# Altium schematic sheet Dc_Dc_SheetSchDoc.SchDoc
size A2
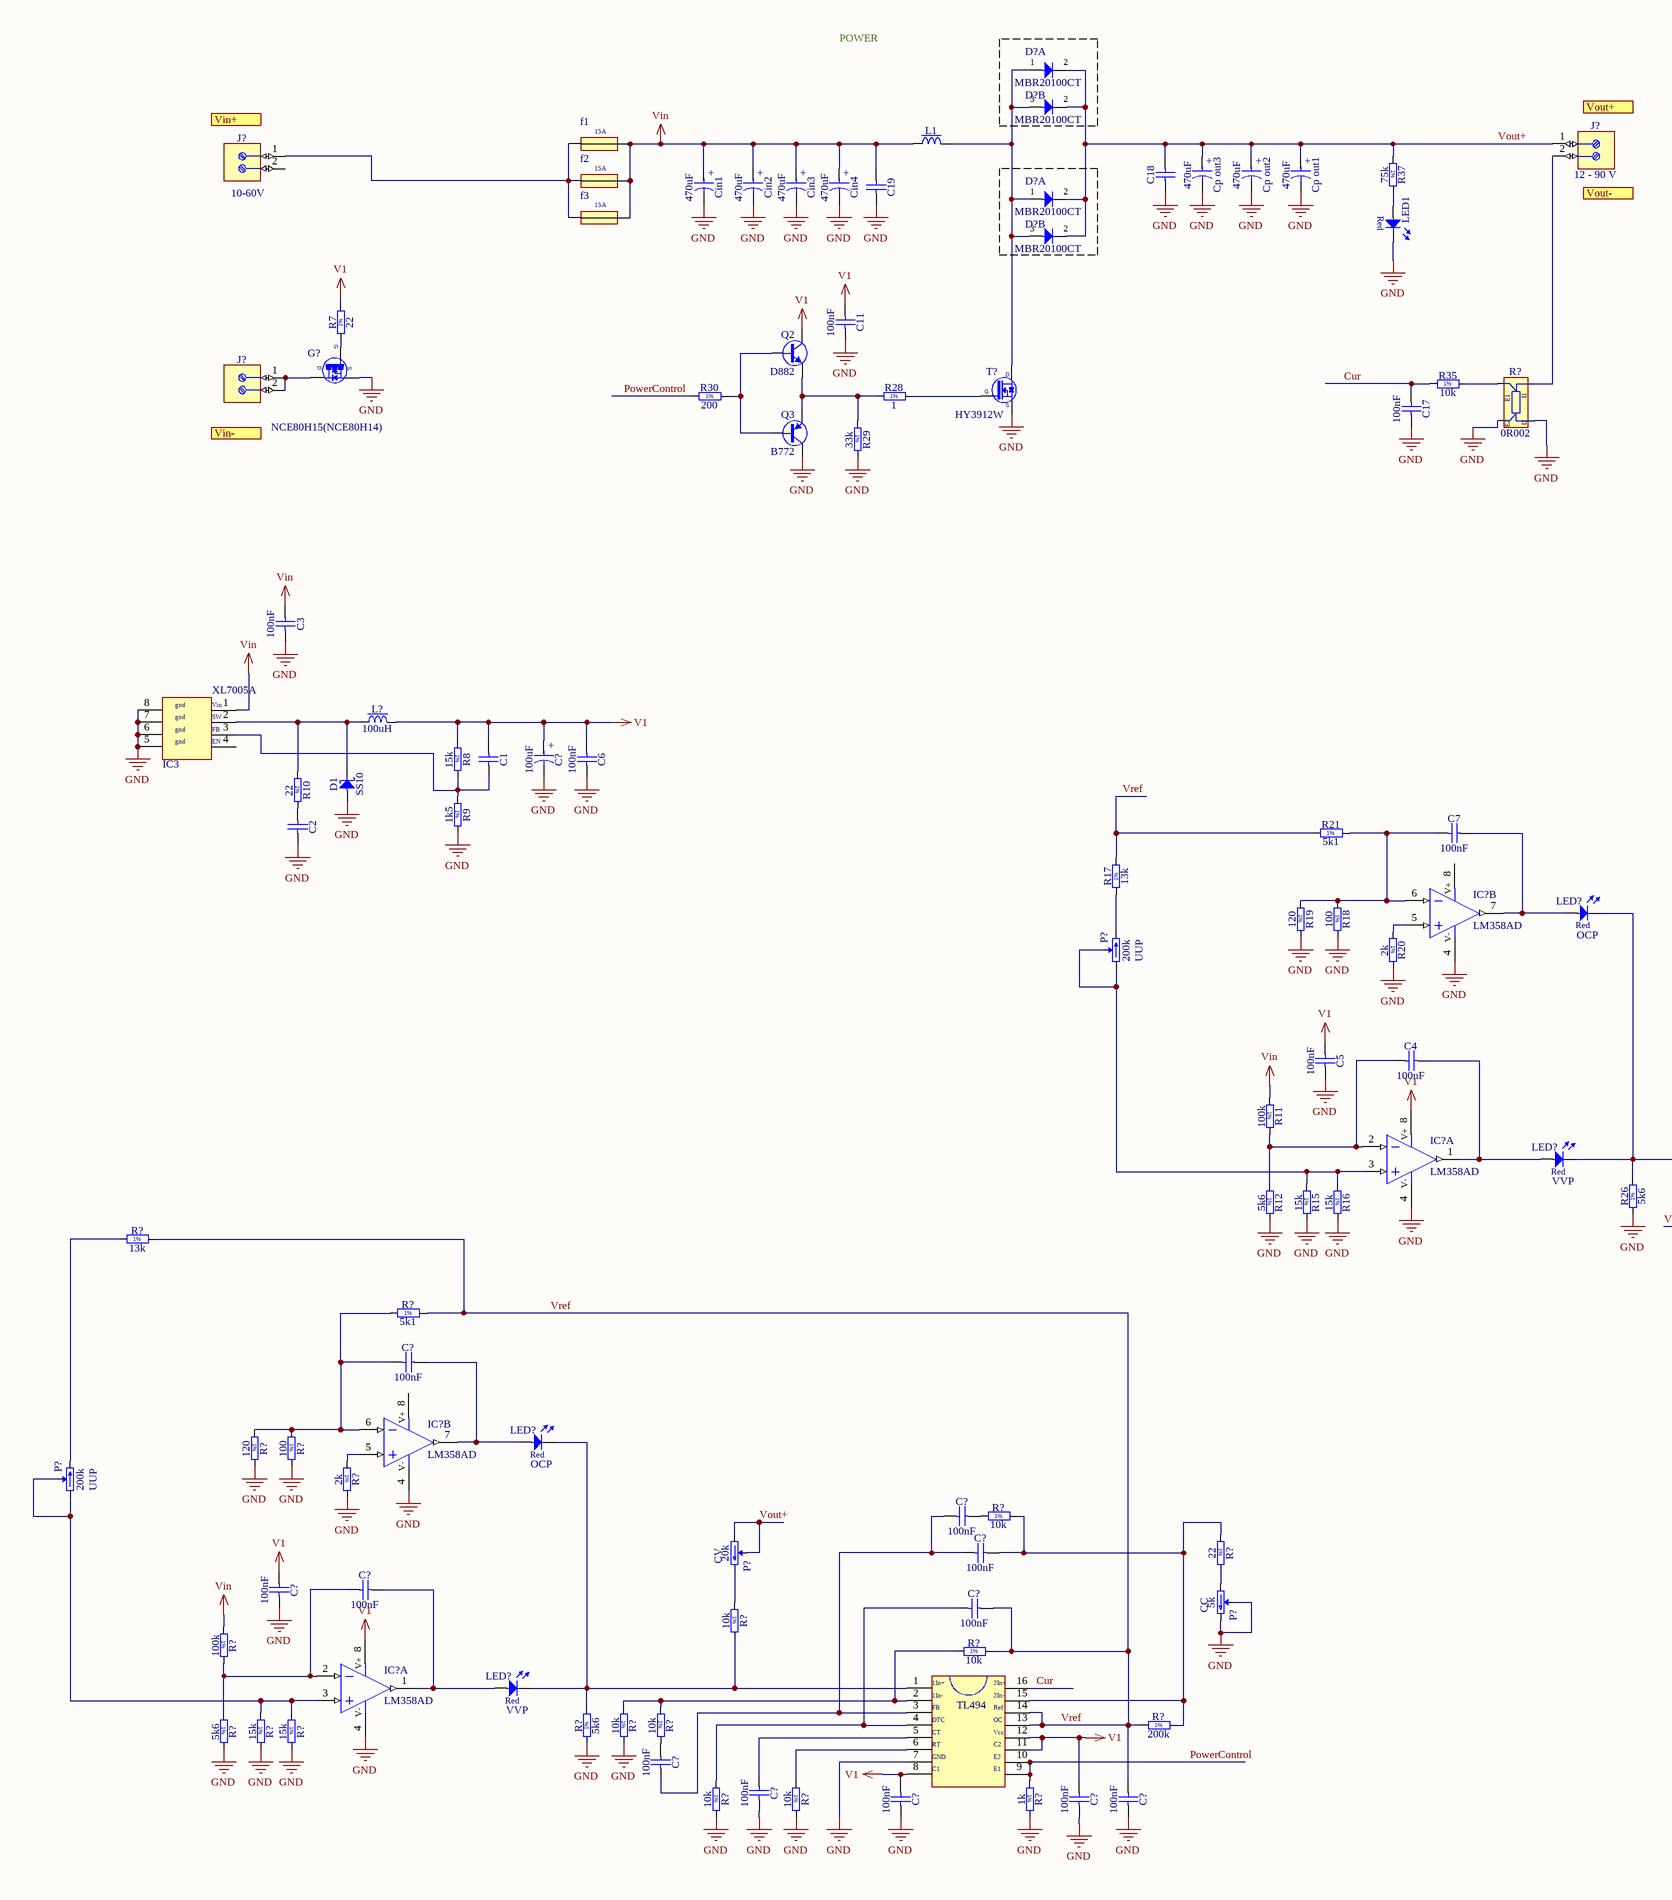
[diagram p0: Dc_Dc_SheetSchDoc.SchDoc, left]
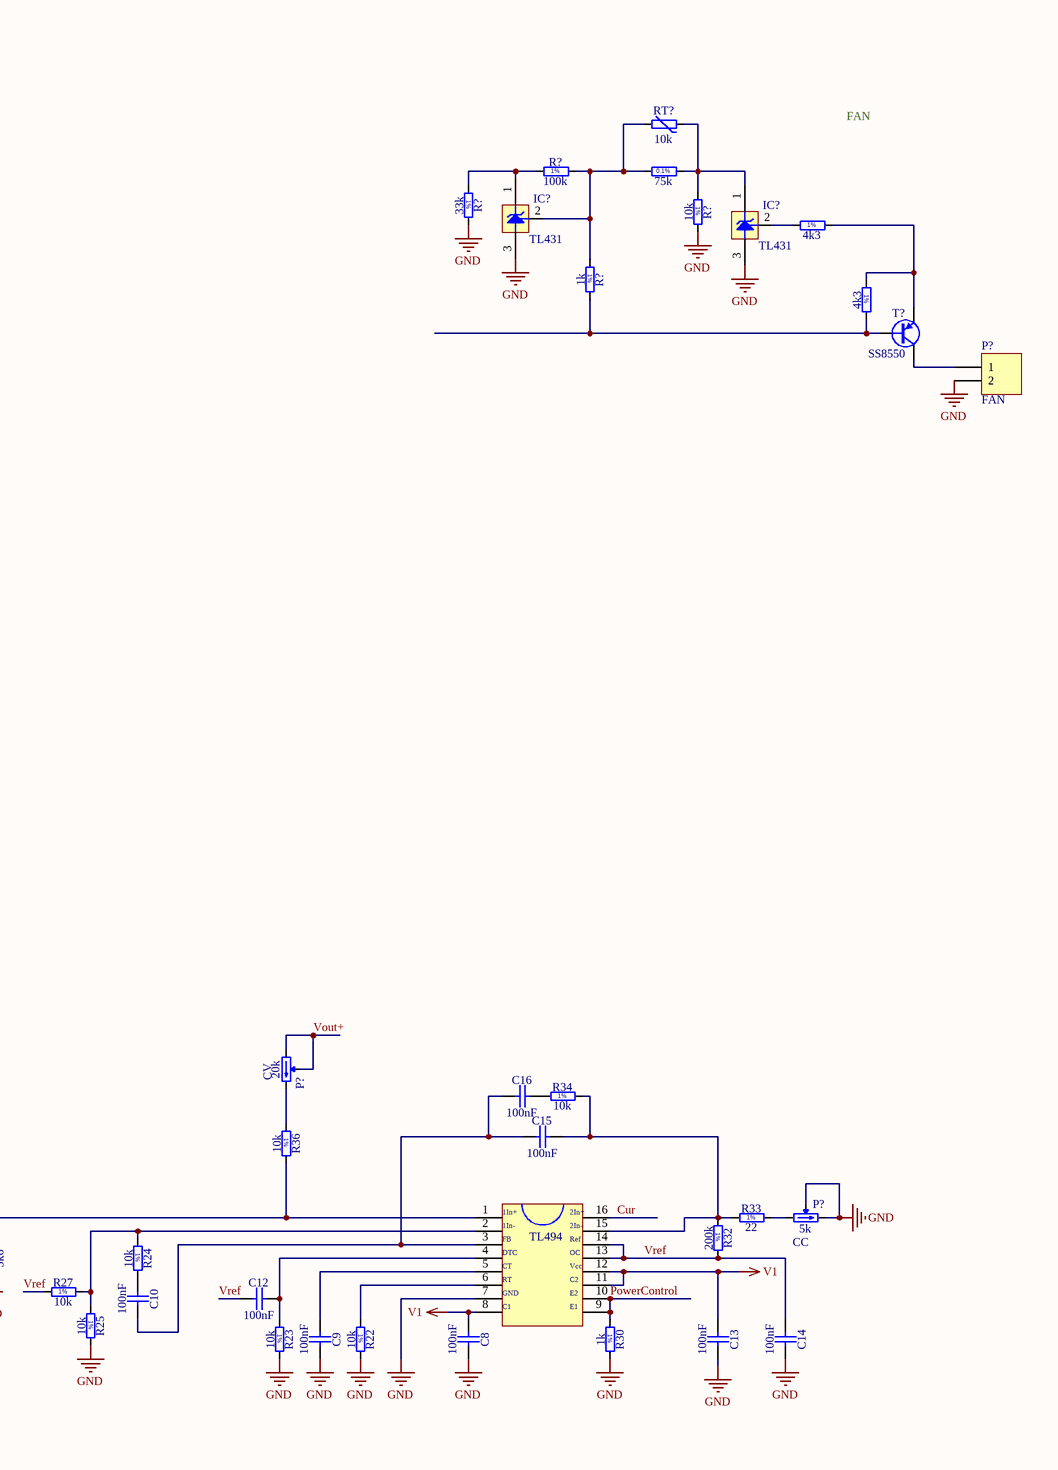
[diagram p1: Dc_Dc_SheetSchDoc.SchDoc, right]

## Parts
(Parts that share a designator on the sheet are numbered #1, #2 ... from top to bottom, then left to right.)
1  1  (value not drawn)  (part B of 2)
?  1  (value not drawn)  (part B of 2)
C1  100nF  [CAPC2012X135N]  (value not drawn)
C2  100nF  [CAPC2012X135N]  (value not drawn)
C3  100nF  [CAPC2012X135N]
C4  100nF  [CAPC2012X135N]
C5  100nF  [CAPC2012X135N]
C6  100nF  [CAPC2012X135N]
C7  100nF  [CAPC2012X135N]
C8  100nF  [CAPC2012X135N]
C9  100nF  [CAPC2012X135N]
C10  100nF  [CAPC2012X135N]
C11  100nF  [CAPC2012X135N]
C12  100nF  [CAPC2012X135N]
C13  100nF  [CAPC2012X135N]
C14  100nF  [CAPC2012X135N]
C15  100nF  [CAPC2012X135N]
C16  100nF  [CAPC2012X135N]
C17  100nF  [CAPC2012X135N]
C18  470nF  [CAPC3216X100N]  (value not drawn)
C19  470nF  [CAPC3216X100N]  (value not drawn)
C?#1  100uF  [CAPPR250-680X1250]
C?#2  100nF  [CAPC2012X135N]
C?#3  100nF  [CAPC2012X135N]
C?#4  100nF  [CAPC2012X135N]
C?#5  100nF  [CAPC2012X135N]
C?#6  100nF  [CAPC2012X135N]
C?#7  100nF  [CAPC2012X135N]
C?#8  100nF  [CAPC2012X135N]
C?#9  100nF  [CAPC2012X135N]
C?#10  100nF  [CAPC2012X135N]
C?#11  100nF  [CAPC2012X135N]
C?#12  100nF  [CAPC2012X135N]
Cin1  470uF  [CAPPR750-1650X2700]
Cin2  470uF  [CAPPR750-1650X2700]
Cin3  470uF  [CAPPR750-1650X2700]
Cin4  470uF  [CAPPR750-1650X2700]
Cp_out1  470uF  [CAPPR750-1650X2700]
Cp_out2  470uF  [CAPPR750-1650X2700]
Cp_out3  470uF  [CAPPR750-1650X2700]
D1  SS10  [DIOM5127X229N]
D?#1  MBR20100CT  [TO-220-V]  (part A of 2)
D?#2  MBR20100CT  [TO-220-V]  (part B of 2)
D?#3  MBR20100CT  [TO-220-V]  (part A of 2)
D?#4  MBR20100CT  [TO-220-V]  (part B of 2)
f1  fuse  (value not drawn)
f2  fuse  (value not drawn)
f3  fuse  (value not drawn)
G?  NCE80H15(NCE80H14)  [TO-220-v]
IC3  XL7005A  (value not drawn)
IC?#1  TL431  [SOT95P237X112-3N]
IC?#2  TL431  [SOT95P237X112-3N]
IC?#3  LM358AD  [SOIC127P600X175-8N]  (part B of 2)
IC?#4  LM358AD  [SOIC127P600X175-8N]  (part A of 2)
IC?#5  LM358AD  [SOIC127P600X175-8N]  (part B of 2)
IC?#6  LM358AD  [SOIC127P600X175-8N]  (part A of 2)
J?#1  12 - 90 V  [PHOENIX_1714971]
J?#2  10-60V  [PHOENIX_1715721]
J?#3  (no value)  [PHOENIX_1715721]
L1  1mH  [IND_BOURNS_2124-V-RC]  (value not drawn)
L?  100uH  [IND_BOURNS_SDE0604A]
LED1  Super Red  [LED_OSRAM_LSR976]  (value not drawn)
LED?#1  Parameter 1: OCP  [LED_OSRAM_LSR976]  (hidden comment: Super Red)
LED?#2  Parameter 1: VVP  [LED_OSRAM_LSR976]  (hidden comment: Super Red)
LED?#3  Parameter 1: OCP  [LED_OSRAM_LSR976]  (hidden comment: Super Red)
LED?#4  Parameter 1: VVP  [LED_OSRAM_LSR976]  (hidden comment: Super Red)
P?#1  FAN  [NX2500-02SMS]
P?#2  200k  Parameter 1: UUP  [TRIM_BOURNS_3290W]
P?#3  20k  Parameter 1: CV  [TRIM_BOURNS_3290W]
P?#4  5k  Parameter 1: CC  [TRIM_BOURNS_3290W]
P?#5  200k  Parameter 1: UUP  [TRIM_BOURNS_3290W]
P?#6  20k  Parameter 1: CV  [TRIM_BOURNS_3290W]
P?#7  5k  Parameter 1: CC  [TRIM_BOURNS_3290W]
Q2  D882  [SOT89]
Q3  B772  [SOT89]
R7  22  [RESC2012X70N]
R8  15k  [RESC2012X60N]
R9  1k5  [RESC2012X60N]
R10  22  [RESC2012X60N]
R11  100k  [RESC2012X60N]
R12  5k6  [RESC2012X60N]
R15  15k  [RESC2012X60N]
R16  15k  [RESC2012X60N]
R17  13k  [RESC2012X60N]
R18  100  [RESC2012X60N]
R19  120  [RESC2012X60N]
R20  2k  [RESC2012X60N]
R21  5k1  [RESC2012X60N]
R22  10k  [RESC2012X60N]
R23  10k  [RESC2012X60N]
R24  10k  [RESC2012X60N]
R25  10k  [RESC2012X60N]
R26  5k6  [RESC2012X60N]
R27  10k  [RESC2012X60N]
R28  1  [RESC2012X60N]
R29  33k  [RESC2012X60N]
R30#1  200  [RESC2012X60N]
R30#2  1k  [RESC2012X60N]
R32  200k  [RESC2012X60N]
R33  22  [RESC2012X60N]
R34  10k  [RESC2012X60N]
R35  10k  [RESC2012X60N]
R36  10k  [RESC2012X60N]
R37  75k  [RESC2012X60N]
R?#1  100k  [RESC2012X60N]
R?#2  75k  [RESC2012X60N]
R?#3  33k  [RESC2012X60N]
R?#4  10k  [RESC1005X40N]
R?#5  4k3  [RESC1005X40N]
R?#6  1k  [RESC2012X60N]
R?#7  4k3  [RESC1005X40N]
R?#8  0R002  [RES_VISHAY_WSK2512_0R005-0R2]
R?#9  13k  [RESC2012X60N]
R?#10  5k1  [RESC2012X60N]
R?#11  120  [RESC2012X60N]
R?#12  100  [RESC2012X60N]
R?#13  2k  [RESC2012X60N]
R?#14  10k  [RESC2012X60N]
R?#15  22  [RESC2012X60N]
R?#16  10k  [RESC2012X60N]
R?#17  100k  [RESC2012X60N]
R?#18  10k  [RESC2012X60N]
R?#19  10k  [RESC2012X60N]
R?#20  10k  [RESC2012X60N]
R?#21  5k6  [RESC2012X60N]
R?#22  15k  [RESC2012X60N]
R?#23  15k  [RESC2012X60N]
R?#24  200k  [RESC2012X60N]
R?#25  5k6  [RESC2012X60N]
R?#26  10k  [RESC2012X60N]
R?#27  10k  [RESC2012X60N]
R?#28  1k  [RESC2012X60N]
RT?  10k  [THERM_VISHAY_2381 640 5XXXX]
T?#1  SS8550  [SOT95P230X110-3N]
T?#2  HY3912W  [TO-247AC-v]

## Ports
Vin+ (in), Vin- (in), Vout+ (out), Vout- (out)

## Nets
GND: 1.7 ?.7 C2.2 C3.2 C5.2 C6.2 C8.2 C9.2 C11.2 C13.2 C14.2 C17.2 C18.1 C19.2 C?#1.2 C?#5.2 C?#9.2 C?#10.2 C?#11.2 C?#12.2 Cin1.2 Cin2.2 Cin3.2 Cin4.2 Cp_out1.2 Cp_out2.2 Cp_out3.2 D1.2(A) G?.3(S) IC3.5 IC3.6 IC3.7 IC3.8 IC?#1.3(A) IC?#2.3(A) IC?#3.4(V-) IC?#4.4(V-) IC?#5.4(V-) IC?#6.4(V-) LED1.1(C) P?#1.2 P?#4.2(W) P?#4.3(CW) P?#7.2(W) P?#7.3(CW) Q3.2(C) R9.2 R12.2 R15.2 R16.2 R18.2 R19.2 R20.2 R22.2 R23.2 R25.2 R26.1 R29.2 R30#2.2 R?#3.2 R?#4.2 R?#8.E2 R?#8.I2 R?#11.2 R?#12.2 R?#13.2 R?#19.2 R?#21.2 R?#22.2 R?#23.2 R?#25.1 R?#26.2 R?#27.2 R?#28.2 T?#2.3(S)
V1: 1.8 1.11 1.12 ?.8 ?.11 ?.12 C1.1 C5.1 C6.1 C8.1 C11.1 C13.1 C?#1.1 C?#5.1 C?#10.1 C?#11.1 IC?#4.8(V+) IC?#6.8(V+) L?.2 Q2.2(C) R7.2 R8.1
Vin: C3.1 C19.1 Cin1.1 Cin2.1 Cin3.1 Cin4.1 f1.2 f2.2 f3.2 IC3.1 L1.1 R11.1 R?#17.1
Cur: 1.16 ?.16 C17.1 R35.1
PowerControl: 1.9 1.10 ?.9 ?.10 R30#1.1 R30#2.1 R?#28.1
Vout+: C18.2 Cp_out1.1 Cp_out2.1 Cp_out3.1 D?#1.2(COMC) D?#2.2(COMC) D?#3.2(COMC) D?#4.2(COMC) J?#1.1 P?#3.1(CCW) P?#3.2(W) P?#6.1(CCW) P?#6.2(W) R37.1
Vref: 1.13 1.14 ?.13 ?.14 C12.1 C14.1 C?#7.2 C?#12.1 R17.2 R21.1 R27.1 R32.2 R?#9.2 R?#10.2 R?#18.2 R?#24.1
Net1_1: 1.1 LED?#1.1(C) LED?#2.1(C) R26.2 R36.2
Net1_2: 1.2 R24.1 R25.1 R27.2
Net1_3: 1.3 C10.2 C15.1 C16.1
Net1_4: 1.4 C12.2 R23.1
Net1_5: 1.5 C9.1
Net1_6: 1.6 R22.1
Net1_15: 1.15 C15.2 R32.1 R33.1 R34.2
Net?_1: ?.1 LED?#3.1(C) LED?#4.1(C) R?#16.2 R?#25.2
Net?_2: ?.2 R?#18.1 R?#19.1 R?#20.1
Net?_3: ?.3 C?#3.1 C?#4.1 C?#8.2
Net?_4: ?.4 C?#7.1 R?#26.1
Net?_5: ?.5 C?#9.1
Net?_6: ?.6 R?#27.1
Net?_15: ?.15 C?#4.2 R?#14.2 R?#15.1 R?#24.2
NetC1_2: C1.2 IC3.3 R8.2 R9.1
NetC2_1: C2.1 R10.2
NetC4_1: C4.1 IC?#4.2(IN-) R11.2 R12.1
NetC4_2: C4.2 IC?#4.1(OUT) LED?#2.2(A)
NetC7_1: C7.1 IC?#3.6(IN-) R18.1 R19.1 R21.2
NetC7_2: C7.2 IC?#3.7(OUT) LED?#1.2(A)
NetC10_1: C10.1 R24.2
NetC16_2: C16.2 R34.1
NetC?#2_1: C?#2.1 IC?#5.6(IN-) R?#10.1 R?#11.1 R?#12.1
NetC?#2_2: C?#2.2 IC?#5.7(OUT) LED?#3.2(A)
NetC?#3_2: C?#3.2 R?#14.1
NetC?#6_1: C?#6.1 IC?#6.2(IN-) R?#17.2 R?#21.1
NetC?#6_2: C?#6.2 IC?#6.1(OUT) LED?#4.2(A)
NetC?#8_1: C?#8.1 R?#20.2
NetD1_1: D1.1(C) IC3.2 L?.1 R10.1
NetD?#1_1: D?#1.1(A) D?#2.3(A) D?#3.1(A) D?#4.3(A) L1.2 T?#2.2(D)
Netf1_1: f1.1 f2.1 f3.1 J?#2.1
NetG?_1: G?.1(G) R7.1
NetG?_2: G?.2(D) J?#3.1 J?#3.2
NetIC?#1_1: IC?#1.1(C) R?#1.1 R?#3.1
NetIC?#1_2: IC?#1.2(Adj) R?#1.2 R?#2.1 R?#6.1 RT?.1
NetIC?#2_1: IC?#2.1(C) R?#2.2 R?#4.1 RT?.2
NetIC?#2_2: IC?#2.2(Adj) R?#5.1
NetIC?#3_5: IC?#3.5(IN+) R20.1
NetIC?#4_3: IC?#4.3(IN+) P?#2.1(CCW) P?#2.2(W) R15.1 R16.1
NetIC?#5_5: IC?#5.5(IN+) R?#13.1
NetIC?#6_3: IC?#6.3(IN+) P?#5.1(CCW) P?#5.2(W) R?#22.1 R?#23.1
NetJ?#1_2: J?#1.2 R?#8.I1
NetLED1_2: LED1.2(A) R37.2
NetP?#1_1: P?#1.1 T?#1.3(C)
NetP?#2_3: P?#2.3(CW) R17.1
NetP?#3_3: P?#3.3(CW) R36.1
NetP?#4_1: P?#4.1(CCW) R33.2
NetP?#5_3: P?#5.3(CW) R?#9.1
NetP?#6_3: P?#6.3(CW) R?#16.1
NetP?#7_1: P?#7.1(CCW) R?#15.2
NetQ2_1: Q2.1(B) Q3.1(B) R30#1.2
NetQ2_3: Q2.3(E) Q3.3(E) R28.1 R29.1
NetR28_2: R28.2 T?#2.1(G)
NetR35_2: R35.2 R?#8.E1
NetR?#5_2: R?#5.2 R?#7.1 T?#1.2(E)
NetR?#6_2: R?#6.2 R?#7.2 T?#1.1(B)

Not connected (* = marked no-connect by the designer): IC3 4; IC?#3 8(V+); IC?#5 8(V+); J?#2 2

## Notes on the sheet
- POWER
- FAN
- Title
- Size:
- Date:
- File:
- A2
- Number:
- Time:
- Revision:
- Sheet
- of
- (in symbol CAER_100UF_25V_20%_NICHICON_UPS1E101MED) +
- (in symbol CAER_470UF_63V_20%_750-1650X2700_LESR0R055) +
- (in symbol Component_1, part B) 1In+; 2In+; 1In-; 2In-; FB; TL494; Ref; DTC; OC; CT; Vcc; RT; C2; GND; E2; C1; E1
- (in symbol fuse) 15A
- (in symbol LED_OSRAM_LSR976) Red
- (in symbol R0402_4K3_1%_0.0625W_100PPM) 1%
- (in symbol R0402_10K_1%_0.0625W_100PPM) 1%
- (in symbol R0805_1K5_1%_0.125W_100PPM) 1%
- (in symbol R0805_1K_1%_0.125W_100PPM) 1%
- (in symbol R0805_1R_1%_0.125W_200PPM) 1%
- (in symbol R0805_2K_1%_0.125W_100PPM) 1%
- (in symbol R0805_5K1_1%_0.125W_100PPM) 1%
- (in symbol R0805_5K6_1%_0.125W_100PPM) 1%
- (in symbol R0805_10K_1%_0.125W_100PPM) 1%
- (in symbol R0805_13K_1%_0.125W_100PPM) 1%
- (in symbol R0805_15K_1%_0.125W_100PPM) 1%
- (in symbol R0805_20R_1%_0.5W_300PPM_PANASONIC_ERJP) 1%
- (in symbol R0805_22R_1%_0.125W_100PPM) 1%
- (in symbol R0805_33K_1%_0.125W_100PPM) 1%
- (in symbol R0805_75K_0.1%_0.125W_25PPM) 0.1%
- (in symbol R0805_75K_1%_0.125W_100PPM) 1%
- (in symbol R0805_100K_1%_0.125W_100PPM) 1%
- (in symbol R0805_100R_1%_0.125W_100PPM) 1%
- (in symbol R0805_120R_1%_0.125W_100PPM) 1%
- (in symbol R0805_200K_1%_0.125W_100PPM) 1%
- (in symbol R0805_200R_1%_0.125W_100PPM) 1%
- (in symbol XL7005A) gnd; Vin; SW; FB; EN

## Library data of the parts
1 ? = Component_1
C1-C17 C?#2-C?#12 = CC0805_100NF_50V_10%_X7R: Non-polarised capacitor; Part Description: SMD Multilayer Chip Ceramic Capacitor; Manufacturer: GENERIC; Manufacturer1 Part Number: C2012X7R1H104K085AA; Voltage: 50V; TC: X7R; Tolerance: ±10%; Part Number: CC0805_100NF_50V_10%_X7R; Component Kind: Standard; Component Type: Standard; Pin Count: 2; Value: 100nF; Status: Preferred; Manufacturer Part Number: CC0805_100NF_50V_10%_X7R; Case: 0805; Mounted: Yes; Socket: No; SMD: Yes; Sense: No; Manufacturer1 Example: TDK; Manufacturer1 ComponentHeight: 1mm; HelpURL: \\cern.ch\dfs\Applications\Altium\Datasheets\CC0805_X7R_TDK_C.pdf; Author: CERN DEM JLC; CreateDate: 03.12.2007; LatestRevisionDate: 22.04.2015
C18 C19 = CC1206_470NF_50V_10%_X7R: Non-polarised capacitor; Part Description: SMD Multilayer Chip Ceramic Capacitor; Manufacturer: GENERIC; Manufacturer1 Part Number: C1206C474K5RACTU; Voltage: 50V; TC: X7R; Tolerance: ±10%; Part Number: CC1206_470NF_50V_10%_X7R; Component Kind: Standard; Component Type: Standard; Pin Count: 2; Value: 470nF; Status: Preferred; Manufacturer Part Number: CC1206_470nF_50V_10%_X7R; Case: 1206; Mounted: Yes; Socket: No; SMD: Yes; Sense: No; Manufacturer1 Example: KEMET; Manufacturer1 ComponentHeight: 1.0mm; HelpURL: \\cern.ch\dfs\Applications\Altium\Datasheets\CC1206_X7R_KEMET.pdf; Author: CERN DEM JLC; CreateDate: 04.12.2012; LatestRevisionDate: 04.12.2012
C?#1 = CAER_100UF_25V_20%_NICHICON_UPS1E101MED: Polarised capacitor; Part Description: Aluminium Electrolytic Capacitor (UPS Series); Voltage: 25V; Tolerance: ±20%; Part Number: CAER_100UF_25V_20%_NICHICON_UPS1E101MED; Component Kind: Standard; Component Type: Standard; Pin Count: 2; Value: 100uF; Status: None; Manufacturer: NICHICON; Manufacturer Part Number: UPS1E101MED; Case: LS2.5 D6.3 x H11; Mounted: Yes; Socket: No; SMD: No; Sense: No; ComponentHeight: 12.5mm; HelpURL: \\cern.ch\dfs\Applications\Altium\Datasheets\CAER_NICHICON_UPS.pdf; Author: CERN DEM MR; CreateDate: 5/30/2016; LatestRevisionDate: 5/30/2016
Cin1-Cin4 Cp_out1-Cp_out3 = CAER_470UF_63V_20%_750-1650X2700_LESR0R055: Polarised capacitor; Part Description: Low ESR 0R055 Aluminum Electrolytic Capacitor; Manufacturer: VISHAY BCCOMPONENTS; Manufacturer Part Number: MAL213668471E3 Series 136RVI; Voltage: 63V; Tolerance: ±20%; Part Number: CAER_470UF_63V_20%_750-1650X2700_LESR0R055; Component Kind: Standard; Component Type: Standard; Pin Count: 2; Value: 470uF; Status: Preferred; Case: LS7.5 D16.5 x H27; Mounted: Yes; Socket: No; SMD: No; Sense: No; ComponentHeight: 27mm; HelpURL: \\cern.ch\dfs\Applications\Altium\Datasheets\CAER-LESR_VISHAY_136RVI.pdf; Author: CERN DEM JLC; CreateDate: 05.06.2008; LatestRevisionDate: 16.03.2009
D1 = SS16: Schottky Diode; Part Number: SS16; Part Description: Surface Mount Schottky Barrier Rectifier; Manufacturer: VISHAY GENERAL SEMICONDUCTOR; Voltage: 60V; Power: 1A; PressFit: No; Bonding: No; Component Kind: Standard; Component Type: Standard; Device: SS16; PackageDescription: DO-214-AC Molded Diode, Body 5.1x2.7mm, IPC Medium Density; Manufacturer Part Number: SS16; Pin Count: 2; Case: DO-214AC; Mounted: Yes; Socket: No; SMD: Yes; Sense: No; ComponentHeight: 2.29mm; HelpURL: \\cern.ch\dfs\Applications\Altium\Datasheets\SS16.pdf; Author: CERN DEM JLC; CreateDate: 7/15/2008; LatestRevisionDate: 8/23/2010
D?#1-D?#4 = MBR20200CT_v: Dual Common Cathode Diodes; Part Description: Switch‐mode Power Rectifier (Common Cathode); Manufacturer: ON SEMICONDUCTOR; Voltage: 200V; Power: 20A; PressFit: No; Bonding: No; Part Number: MBR20200CT_v; Component Kind: Standard; Component Type: Standard; Device: MBR20200CT; PackageDescription: TO-220 3-Terminal - Vertical; Manufacturer Part Number: MBR20200CT; Pin Count: 3; Case: TO-220-V; Mounted: Yes; Socket: No; SMD: No; Sense: No; ComponentHeight: 19.85mm; HelpURL: \\cern.ch\dfs\Applications\Altium\Datasheets\MBR20200CT.pdf; Author: CERN DEM JLC; CreateDate: 09.06.2015; LatestRevisionDate: 09.06.2015
G? = IPP045N10N3 G_v: N-CHANNEL MOSFET WITH DIODE; Part Description: 100V 100A N-Channel OptiMOS Power-Transistor; Manufacturer: INFINEON; PressFit: No; Bonding: No; Part Number: IPP045N10N3 G_v; Component Kind: Standard; Component Type: Standard; Device: IPP045N10N3 G; PackageDescription: TO-220 3-Terminal - Vertical Mount; Manufacturer Part Number: IPP045N10N3 G; Pin Count: 3; Case: TO-220; Mounted: Yes; Socket: No; SMD: No; Sense: No; ComponentHeight: 20.75mm; HelpURL: \\cern.ch\dfs\Applications\Altium\Datasheets\IPP045N10N3 G.pdf; Author: CERN DEM JLC; CreateDate: 20.06.2013; LatestRevisionDate: 20.06.2013
IC?#1 IC?#2 = TL431IDBZT: Precision Reference 1=Cathode 2=Adj 3=Anode; Part Description: Vref (2.495V) To 36V 2% Precision Programmable Reference; Manufacturer: TEXAS INSTRUMENTS; PressFit: No; Bonding: No; Part Number: TL431IDBZT; Component Kind: Standard; Component Type: Standard; Device: TL431IDBZT; PackageDescription: SOT, 0.95mm, Pitch; 3 Pin,1.30mm W X 2.92mm L X 1.12mm H Body, IPC Medium Density; Manufacturer Part Number: TL431IDBZT; Pin Count: 3; Case: SOT23; Mounted: Yes; Socket: No; SMD: Yes; Sense: No; ComponentHeight: 1.12mm; HelpURL: \\cern.ch\dfs\Applications\Altium\Datasheets\TL431IDBZT.pdf; Author: CERN DEM JLC; CreateDate: 23.04.2012; LatestRevisionDate: 23.04.2012
IC?#3-IC?#6 = LM358AD: Dual Operational Amplifier; Manufacturer: TEXAS INSTRUMENTS; PressFit: No; Bonding: No; Part Number: LM358AD; Component Kind: Standard; Component Type: Standard; Device: LM358AD; PackageDescription: SOIC 8, Pitch 1.27mm - Body 4x5mm, IPC Medium Density; Part Description: Dual Operational Amplifier; Manufacturer Part Number: LM358AD; Pin Count: 8; Case: SOIC8; Mounted: Yes; Socket: No; SMD: Yes; Sense: No; ComponentHeight: 1.75mm; Author: CERN DEM JLC; HelpURL: \\cern.ch\dfs\Applications\Altium\Datasheets\LM358AD.pdf; CreateDate: 02.12.2008; LatestRevisionDate: 13.04.2010
J?#1 = PHOENIX_1714971: Terminal Block, 2 Positions, Screw Connection; Part Description: 32A, 1kV, Terminal Block, Pitch 9.5mm, 2 Positions, Screw Connection; Manufacturer: PHOENIX CONTACT; Manufacturer Part Number: 1714971 (MKDS 5/ 2-9,5); PressFit: No; Part Number: PHOENIX_1714971; Component Kind: Standard; Component Type: Standard; Pin Count: 2; Mounted: Yes; Socket: No; SMD: No; Sense: No; Status: None; ComponentHeight: 21.5mm; HelpURL: \\cern.ch\dfs\Applications\Altium\Datasheets\PHOENIX_1714971.pdf; Author: CERN DEM BC; CreateDate: 23.11.2015; LatestRevisionDate: 23.11.2015
J?#2 J?#3 = PHOENIX_1715721: Terminal Block, 2 Positions, Screw Connection; Part Description: 17.5A, 400V, Terminal Block, Pitch 5.08mm, 2 Positions, Screw Connection; Manufacturer: PHOENIX CONTACT; Manufacturer Part Number: 1715721 (MKDS 1,5/2-5,08); PressFit: No; Part Number: PHOENIX_1715721; Component Kind: Standard; Component Type: Standard; Pin Count: 2; Mounted: Yes; Socket: No; SMD: No; Sense: No; Status: None; ComponentHeight: 13.8mm; HelpURL: \\cern.ch\dfs\Applications\Altium\Datasheets\PHOENIX_1715721.pdf; Author: CERN DEM JLC; CreateDate: 06.01.2010; LatestRevisionDate: 25.02.2013
L1 = IND_1MH_BOURNS_2124-V-RC: Inductor With Core; Part Description: High Current Vertical Leaded Toroid Inductor; Manufacturer: BOURNS; Power: 1.3A; Resistance: 0.4R; Tolerance: ±15%; Part Number: IND_1MH_BOURNS_2124-V-RC; Component Kind: Standard; Component Type: Standard; Pin Count: 2; Value: 1mH; Manufacturer Part Number: 2124-V-RC; Case: LS9.39 D21.84 x W11.43; Mounted: Yes; Socket: No; SMD: No; Sense: No; ComponentHeight: 21.84mm; HelpURL: \\cern.ch\dfs\Applications\Altium\Datasheets\IND_BOURNS_2124-V-RC.pdf; Author: CERN DEM JLC; CreateDate: 02.03.2015; LatestRevisionDate: 02.03.2015
L? = IND_12UH_20%_BOURNS_SDE0604A: Inductor With Core; Part Description: SMD Power Inductors; Manufacturer: BOURNS; Manufacturer Part Number: SDE0604A-120M; Value: 12uH; Power: 2.5A; Resistance: 0.12R; Tolerance: ±20%; Part Number: IND_12UH_20%_BOURNS_SDE0604A; Component Kind: Standard; Component Type: Standard; Pin Count: 2; Status: None; Mounted: Yes; Socket: No; SMD: Yes; Sense: No; ComponentHeight: 4.8mm; HelpURL: \\cern.ch\dfs\Applications\Altium\Datasheets\IND_BOURNS_SDE0604A.pdf; Author: CERN DEM MR; CreateDate: 3/14/2016; LatestRevisionDate: 3/14/2016
LED1 LED?#1-LED?#4 = LED_OSRAM_LSR976: LED Red 1C 2A; Part Description: Surface Mount Super Red LED (0805 Case); Manufacturer: OSRAM; Manufacturer Part Number: LSR976; PressFit: No; Bonding: No; Part Number: LED_OSRAM_LSR976; Component Kind: Standard; Component Type: Standard; Color: Super Red; PackageDescription: Super Red Chip LED, 2-Leads, Body 2 x1.25mm, IPC Medium Density; Pin Count: 2; Case: 0805; Mounted: Yes; Socket: No; SMD: Yes; Sense: No; ComponentHeight: 0.9mm; HelpURL: \\cern.ch\dfs\Applications\Altium\Datasheets\LED_OSRAM_LSR976.pdf; Author: CERN DEM JLC; CreateDate: 18.05.2010; LatestRevisionDate: 18.05.2010
P?#1 = Header 2: Header, 2-Pin; LatestRevisionDate: 17-Jul-2002; LatestRevisionNote: Re-released for DXP Platform.; Publisher: Altium Limited
P?#2 P?#4 P?#5 P?#7 = TRIM_25T_20K_BOURNS_3290W-1-203: Trimming Potentiometer; Part Description: 25 Turn Trimming Potentiometer (Top Adjustement); Manufacturer: BOURNS; Value: 20k; Power: 1W; TC: ±50ppm/°C; Tolerance: ±5%; PressFit: No; Part Number: TRIM_25T_20K_BOURNS_3290W-1-203; Component Kind: Standard; Component Type: Standard; Pin Count: 3; Manufacturer Part Number: 3290W-1-203; Case: 3290W; Mounted: Yes; Socket: No; SMD: No; Sense: No; ComponentHeight: 9.91mm; HelpURL: \\cern.ch\dfs\Applications\Altium\Datasheets\TRIM_BOURNS_3290W.pdf; Author: CERN DEM BC; CreateDate: 01.03.2017; LatestRevisionDate: 01.03.2017
P?#3 P?#6 = TRIM_25T_20K_BOURNS_3290W-1-203: Trimming Potentiometer; Part Description: 25 Turn Trimming Potentiometer (Top Adjustement); Manufacturer: BOURNS; Power: 1W; TC: ±50ppm/°C; Tolerance: ±5%; PressFit: No; Part Number: TRIM_25T_20K_BOURNS_3290W-1-203; Component Kind: Standard; Component Type: Standard; Pin Count: 3; Value: 20k; Manufacturer Part Number: 3290W-1-203; Case: 3290W; Mounted: Yes; Socket: No; SMD: No; Sense: No; ComponentHeight: 9.91mm; HelpURL: \\cern.ch\dfs\Applications\Altium\Datasheets\TRIM_BOURNS_3290W.pdf; Author: CERN DEM BC; CreateDate: 01.03.2017; LatestRevisionDate: 01.03.2017
Q2 = DXT2222A-13: NPN Transistor; Part Description: 40V 600mA NPN Surface Mount Transistor; Manufacturer: DIODES INCORPORATED; PressFit: No; Bonding: No; Part Number: DXT2222A-13; Component Kind: Standard; Component Type: Standard; Device: DXT2222A-13; PackageDescription: SOT89-3, 3-Leads, Body 2.48x4.5mm; Manufacturer Part Number: DXT2222A-13; Pin Count: 4; Case: SOT89; Mounted: Yes; Socket: No; SMD: Yes; Sense: No; ComponentHeight: 1.6mm; HelpURL: \\cern.ch\dfs\Applications\Altium\Datasheets\DXT2222A.pdf; Author: CERN DEM BC; CreateDate: 04.09.2015; LatestRevisionDate: 04.09.2015
Q3 = 2DB1714: PNP Transistor; Part Description: 120V 1A PNP Silicon High Voltage Darlington Transistor; Manufacturer: DIODES INCORPORATED; PressFit: No; Bonding: No; Part Number: 2DB1714; Component Kind: Standard; Component Type: Standard; Device: 2DB1714; PackageDescription: SOT89-3, 3-Leads, Body 2.48x4.5mm; Manufacturer Part Number: 2DB1714; Pin Count: 4; Case: SOT89; Mounted: Yes; Socket: No; SMD: Yes; Sense: No; ComponentHeight: 1.6mm; HelpURL: \\cern.ch\dfs\Applications\Altium\Datasheets\2DB1714.pdf; Author: CERN DEM JLC; CreateDate: 20.04.2015; LatestRevisionDate: 20.04.2015
R7 = R0805_20R_1%_0.5W_300PPM_PANASONIC_ERJP: Resistor - 1%; Part Description: 400V, Anti-Surge Thick Film Chip Resistor; Manufacturer Part Number: ERJP06F20R0V; Value: 20; Power: 0.5W; TC: ±300ppm/°C; Voltage: 400V; PressFit: No; Part Number: R0805_20R_1%_0.5W_300PPM_PANASONIC_ERJP; Component Kind: Standard; Component Type: Standard; Pin Count: 2; Status: None; Tolerance: ±1%; Manufacturer: PANASONIC; Case: 0805; Mounted: Yes; Sense: No; Socket: No; SMD: Yes; ComponentHeight: 0.7mm; HelpURL: \\cern.ch\dfs\Applications\Altium\Datasheets\R0805_PANASONIC_ERJP06.pdf; Author: CERN DEM BC; CreateDate: 29.07.2015; LatestRevisionDate: 20.11.2015
R8 R15 R16 R?#22 R?#23 = R0805_15K_1%_0.125W_100PPM: Resistor - 1%; Part Description: General Purpose Thick Film Chip Resistor; Manufacturer: GENERIC; Manufacturer1 Part Number: NRC10F1502TRF; Power: 0.125W; TC: ±100ppm/°C; PressFit: No; Part Number: R0805_15K_1%_0.125W_100PPM; Component Kind: Standard; Component Type: Standard; Pin Count: 2; Value: 15k; Status: Preferred; Tolerance: ±1%; Manufacturer Part Number: R0805_15K_1%_0.125W_100PPM; Case: 0805; Mounted: Yes; Sense: No; Socket: No; SMD: Yes; Manufacturer1 Example: NIC COMPONENT; Manufacturer1 ComponentHeight: 0.6mm; HelpURL: \\cern.ch\dfs\Applications\Altium\Datasheets\R0805_NIC_NRC.pdf; Author: CERN DEM JLC; CreateDate: 5/13/2013; LatestRevisionDate: 5/13/2013
R9 = R0805_1K5_1%_0.125W_100PPM: Resistor - 1%; Part Description: General Purpose Thick Film Chip Resistor; Manufacturer: GENERIC; Manufacturer1 Part Number: NRC10F1501TRF; Power: 0.125W; TC: ±100ppm/°C; PressFit: No; Part Number: R0805_1K5_1%_0.125W_100PPM; Component Kind: Standard; Component Type: Standard; Pin Count: 2; Value: 1k5; Status: Preferred; Tolerance: ±1%; Manufacturer Part Number: R0805_1K5_1%_0.125W_100PPM; Case: 0805; Mounted: Yes; Sense: No; Socket: No; SMD: Yes; Manufacturer1 Example: NIC COMPONENT; Manufacturer1 ComponentHeight: 0.6mm; HelpURL: \\cern.ch\dfs\Applications\Altium\Datasheets\R0805_NIC_NRC.pdf; Author: CERN DEM JLC; CreateDate: 12/3/2007; LatestRevisionDate: 3/13/2008
R10 R33 R?#15 = R0805_22R_1%_0.125W_100PPM: Resistor - 1%; Part Description: General Purpose Thick Film Chip Resistor; Manufacturer: GENERIC; Manufacturer1 Part Number: NRC10F22R0TRF; Power: 0.125W; TC: ±100ppm/°C; PressFit: No; Part Number: R0805_22R_1%_0.125W_100PPM; Component Kind: Standard; Component Type: Standard; Pin Count: 2; Value: 22; Status: Preferred; Tolerance: ±1%; Manufacturer Part Number: R0805_22R_1%_0.125W_100PPM; Case: 0805; Mounted: Yes; Sense: No; Socket: No; SMD: Yes; Manufacturer1 Example: NIC COMPONENT; Manufacturer1 ComponentHeight: 0.6mm; HelpURL: \\cern.ch\dfs\Applications\Altium\Datasheets\R0805_NIC_NRC.pdf; Author: CERN DEM JLC; CreateDate: 03.12.2007; LatestRevisionDate: 13.03.2008
R11 R?#1 R?#17 = R0805_100K_1%_0.125W_100PPM: Resistor - 1%; Part Description: General Purpose Thick Film Chip Resistor; Manufacturer: GENERIC; Manufacturer1 Part Number: NRC10F1003TRF; Power: 0.125W; TC: ±100ppm/°C; PressFit: No; Part Number: R0805_100K_1%_0.125W_100PPM; Component Kind: Standard; Component Type: Standard; Pin Count: 2; Value: 100k; Status: Preferred; Tolerance: ±1%; Manufacturer Part Number: R0805_100K_1%_0.125W_100PPM; Case: 0805; Mounted: Yes; Sense: No; Socket: No; SMD: Yes; Manufacturer1 Example: NIC COMPONENT; Manufacturer1 ComponentHeight: 0.6mm; HelpURL: \\cern.ch\dfs\Applications\Altium\Datasheets\R0805_NIC_NRC.pdf; Author: CERN DEM JLC
  R11 R?#17: CreateDate: 12/3/2007; LatestRevisionDate: 3/13/2008
  R?#1: CreateDate: 03.12.2007; LatestRevisionDate: 13.03.2008
R12 R26 R?#21 R?#25 = R0805_5K6_1%_0.125W_100PPM: Resistor - 1%; Part Description: General Purpose Thick Film Chip Resistor; Manufacturer: GENERIC; Manufacturer1 Part Number: NRC10F5601TRF; Power: 0.125W; TC: ±100ppm/°C; PressFit: No; Part Number: R0805_5K6_1%_0.125W_100PPM; Component Kind: Standard; Component Type: Standard; Pin Count: 2; Value: 5k6; Status: Preferred; Tolerance: ±1%; Manufacturer Part Number: R0805_5K6_1%_0.125W_100PPM; Case: 0805; Mounted: Yes; Sense: No; Socket: No; SMD: Yes; Manufacturer1 Example: NIC COMPONENT; Manufacturer1 ComponentHeight: 0.6mm; HelpURL: \\cern.ch\dfs\Applications\Altium\Datasheets\R0805_NIC_NRC.pdf; Author: CERN DEM JLC
  R12 R?#21: CreateDate: 12/3/2007; LatestRevisionDate: 3/13/2008
  R26 R?#25: CreateDate: 03.12.2007; LatestRevisionDate: 13.03.2008
R17 R?#9 = R0805_13K_1%_0.125W_100PPM: Resistor - 1%; Part Description: General Purpose Thick Film Chip Resistor; Manufacturer: GENERIC; Manufacturer1 Part Number: NRC10F1302TRF; Power: 0.125W; TC: ±100ppm/°C; PressFit: No; Part Number: R0805_13K_1%_0.125W_100PPM; Component Kind: Standard; Component Type: Standard; Pin Count: 2; Value: 13k; Status: Preferred; Tolerance: ±1%; Manufacturer Part Number: R0805_13K_1%_0.125W_100PPM; Case: 0805; Mounted: Yes; Sense: No; Socket: No; SMD: Yes; Manufacturer1 Example: NIC COMPONENT; Manufacturer1 ComponentHeight: 0.6mm; HelpURL: \\cern.ch\dfs\Applications\Altium\Datasheets\R0805_NIC_NRC.pdf; Author: CERN DEM JLC; CreateDate: 12/3/2007; LatestRevisionDate: 3/13/2008
R18 R?#12 = R0805_100R_1%_0.125W_100PPM: Resistor - 1%; Part Description: General Purpose Thick Film Chip Resistor; Manufacturer: GENERIC; Manufacturer1 Part Number: NRC10F4700TRF; Power: 0.125W; TC: ±100ppm/°C; PressFit: No; Part Number: R0805_100R_1%_0.125W_100PPM; Component Kind: Standard; Component Type: Standard; Pin Count: 2; Value: 100; Status: Preferred; Tolerance: ±1%; Manufacturer Part Number: R0805_100R_1%_0.125W_100PPM; Case: 0805; Mounted: Yes; Sense: No; Socket: No; SMD: Yes; Manufacturer1 Example: NIC COMPONENT; Manufacturer1 ComponentHeight: 0.6mm; HelpURL: \\cern.ch\dfs\Applications\Altium\Datasheets\R0805_NIC_NRC.pdf; Author: CERN DEM JLC; CreateDate: 12/3/2007; LatestRevisionDate: 3/13/2008
R19 R?#11 = R0805_120R_1%_0.125W_100PPM: Resistor - 1%; Part Description: General Purpose Thick Film Chip Resistor; Manufacturer: GENERIC; Manufacturer1 Part Number: NRC10F1200TRF; Power: 0.125W; TC: ±100ppm/°C; PressFit: No; Part Number: R0805_120R_1%_0.125W_100PPM; Component Kind: Standard; Component Type: Standard; Pin Count: 2; Value: 120; Status: Preferred; Tolerance: ±1%; Manufacturer Part Number: R0805_120R_1%_0.125W_100PPM; Case: 0805; Mounted: Yes; Sense: No; Socket: No; SMD: Yes; Manufacturer1 Example: NIC COMPONENT; Manufacturer1 ComponentHeight: 0.6mm; HelpURL: \\cern.ch\dfs\Applications\Altium\Datasheets\R0805_NIC_NRC.pdf; Author: CERN DEM JLC; CreateDate: 12/3/2007; LatestRevisionDate: 3/13/2008
R20 R?#13 = R0805_2K_1%_0.125W_100PPM: Resistor - 1%; Part Description: General Purpose Thick Film Chip Resistor; Manufacturer: GENERIC; Manufacturer1 Part Number: NRC10F2001TRF; Power: 0.125W; TC: ±100ppm/°C; PressFit: No; Part Number: R0805_2K_1%_0.125W_100PPM; Component Kind: Standard; Component Type: Standard; Pin Count: 2; Value: 2k; Status: Preferred; Tolerance: ±1%; Manufacturer Part Number: R0805_2K_1%_0.125W_100PPM; Case: 0805; Mounted: Yes; Sense: No; Socket: No; SMD: Yes; Manufacturer1 Example: NIC COMPONENT; Manufacturer1 ComponentHeight: 0.6mm; HelpURL: \\cern.ch\dfs\Applications\Altium\Datasheets\R0805_NIC_NRC.pdf; Author: CERN DEM JLC; CreateDate: 12/3/2007; LatestRevisionDate: 3/13/2008
R21 R?#10 = R0805_5K1_1%_0.125W_100PPM: Resistor - 1%; Part Description: General Purpose Thick Film Chip Resistor; Manufacturer: GENERIC; Manufacturer1 Part Number: NRC10F5101TRF; Power: 0.125W; TC: ±100ppm/°C; PressFit: No; Part Number: R0805_5K1_1%_0.125W_100PPM; Component Kind: Standard; Component Type: Standard; Pin Count: 2; Value: 5k1; Status: Preferred; Tolerance: ±1%; Manufacturer Part Number: R0805_5K1_1%_0.125W_100PPM; Case: 0805; Mounted: Yes; Sense: No; Socket: No; SMD: Yes; Manufacturer1 Example: NIC COMPONENT; Manufacturer1 ComponentHeight: 0.6mm; HelpURL: \\cern.ch\dfs\Applications\Altium\Datasheets\R0805_NIC_NRC.pdf; Author: CERN DEM JLC; CreateDate: 12/3/2007; LatestRevisionDate: 3/13/2008
R22-R25 R27 R34-R36 R?#14 R?#16 R?#18-R?#20 R?#26 R?#27 = R0805_10K_1%_0.125W_100PPM: Resistor - 1%; Part Description: General Purpose Thick Film Chip Resistor; Manufacturer: GENERIC; Manufacturer1 Part Number: NRC10F1002TRF; Power: 0.125W; TC: ±100ppm/°C; PressFit: No; Part Number: R0805_10K_1%_0.125W_100PPM; Component Kind: Standard; Component Type: Standard; Pin Count: 2; Value: 10k; Status: Preferred; Tolerance: ±1%; Manufacturer Part Number: R0805_10K_1%_0.125W_100PPM; Case: 0805; Mounted: Yes; Sense: No; Socket: No; SMD: Yes; Manufacturer1 Example: NIC COMPONENT; Manufacturer1 ComponentHeight: 0.6mm; HelpURL: \\cern.ch\dfs\Applications\Altium\Datasheets\R0805_NIC_NRC.pdf; Author: CERN DEM JLC; CreateDate: 03.12.2007; LatestRevisionDate: 13.03.2008
R28 = R0805_1R_1%_0.125W_200PPM: Resistor - 1%; Part Description: General Purpose Thick Film Chip Resistor; Manufacturer: GENERIC; Manufacturer1 Part Number: 232273461008L or RC0805FR-071RL; Power: 0.125W; TC: ±200ppm/°C; PressFit: No; Part Number: R0805_1R_1%_0.125W_200PPM; Component Kind: Standard; Component Type: Standard; Pin Count: 2; Value: 1; Status: Preferred; Tolerance: ±1%; Manufacturer Part Number: R0805_1R_1%_0.125W_200PPM; Case: 0805; Mounted: Yes; Sense: No; Socket: No; SMD: Yes; Manufacturer1 Example: YAGEO PHYCOMP; Manufacturer1 ComponentHeight: 0.65mm; HelpURL: \\cern.ch\dfs\Applications\Altium\Datasheets\R0805_Tyco_RN73.pdf; Author: CERN DEM JLC; CreateDate: 03.12.2007; LatestRevisionDate: 17.10.2012
R29 R?#3 = R0805_33K_1%_0.125W_100PPM: Resistor - 1%; Part Description: General Purpose Thick Film Chip Resistor; Manufacturer: GENERIC; Manufacturer1 Part Number: NRC10F3302TRF; Power: 0.125W; TC: ±100ppm/°C; PressFit: No; Part Number: R0805_33K_1%_0.125W_100PPM; Component Kind: Standard; Component Type: Standard; Pin Count: 2; Value: 33k; Status: Preferred; Tolerance: ±1%; Manufacturer Part Number: R0805_33K_1%_0.125W_100PPM; Case: 0805; Mounted: Yes; Sense: No; Socket: No; SMD: Yes; Manufacturer1 Example: NIC COMPONENT; Manufacturer1 ComponentHeight: 0.6mm; HelpURL: \\cern.ch\dfs\Applications\Altium\Datasheets\R0805_NIC_NRC.pdf; Author: CERN DEM JLC; CreateDate: 03.12.2007; LatestRevisionDate: 13.03.2008
R30#1 = R0805_200R_1%_0.125W_100PPM: Resistor - 1%; Part Description: General Purpose Thick Film Chip Resistor; Manufacturer: GENERIC; Manufacturer1 Part Number: NRC10F2000TRF; Power: 0.125W; TC: ±100ppm/°C; PressFit: No; Part Number: R0805_200R_1%_0.125W_100PPM; Component Kind: Standard; Component Type: Standard; Pin Count: 2; Value: 200; Status: Preferred; Tolerance: ±1%; Manufacturer Part Number: R0805_200R_1%_0.125W_100PPM; Case: 0805; Mounted: Yes; Sense: No; Socket: No; SMD: Yes; Manufacturer1 Example: NIC COMPONENT; Manufacturer1 ComponentHeight: 0.6mm; HelpURL: \\cern.ch\dfs\Applications\Altium\Datasheets\R0805_NIC_NRC.pdf; Author: CERN DEM JLC; CreateDate: 03.12.2007; LatestRevisionDate: 13.03.2008
R30#2 R?#6 R?#28 = R0805_1K_1%_0.125W_100PPM: Resistor - 1%; Part Description: General Purpose Thick Film Chip Resistor; Manufacturer: GENERIC; Manufacturer1 Part Number: NRC10F1001TRF; Power: 0.125W; TC: ±100ppm/°C; PressFit: No; Part Number: R0805_1K_1%_0.125W_100PPM; Component Kind: Standard; Component Type: Standard; Pin Count: 2; Value: 1k; Status: Preferred; Tolerance: ±1%; Manufacturer Part Number: R0805_1K_1%_0.125W_100PPM; Case: 0805; Mounted: Yes; Sense: No; Socket: No; SMD: Yes; Manufacturer1 Example: NIC COMPONENT; Manufacturer1 ComponentHeight: 0.6mm; HelpURL: \\cern.ch\dfs\Applications\Altium\Datasheets\R0805_NIC_NRC.pdf; Author: CERN DEM JLC; CreateDate: 03.12.2007; LatestRevisionDate: 13.03.2008
R32 R?#24 = R0805_200K_1%_0.125W_100PPM: Resistor - 1%; Part Description: General Purpose Thick Film Chip Resistor; Manufacturer: GENERIC; Manufacturer1 Part Number: NRC10F2003TRF; Power: 0.125W; TC: ±100ppm/°C; PressFit: No; Part Number: R0805_200K_1%_0.125W_100PPM; Component Kind: Standard; Component Type: Standard; Pin Count: 2; Value: 200k; Status: Preferred; Tolerance: ±1%; Manufacturer Part Number: R0805_200K_1%_0.125W_100PPM; Case: 0805; Mounted: Yes; Sense: No; Socket: No; SMD: Yes; Manufacturer1 Example: NIC COMPONENT; Manufacturer1 ComponentHeight: 0.6mm; HelpURL: \\cern.ch\dfs\Applications\Altium\Datasheets\R0805_NIC_NRC.pdf; Author: CERN DEM JLC; CreateDate: 03.12.2007; LatestRevisionDate: 13.03.2008
R37 = R0805_75K_1%_0.125W_100PPM: Resistor - 1%; Part Description: General Purpose Thick Film Chip Resistor; Manufacturer: GENERIC; Manufacturer1 Part Number: NRC10F7502TRF; Power: 0.125W; TC: ±100ppm/°C; PressFit: No; Part Number: R0805_75K_1%_0.125W_100PPM; Component Kind: Standard; Component Type: Standard; Pin Count: 2; Value: 75k; Status: Preferred; Tolerance: ±1%; Manufacturer Part Number: R0805_75K_1%_0.125W_100PPM; Case: 0805; Mounted: Yes; Sense: No; Socket: No; SMD: Yes; Manufacturer1 Example: NIC COMPONENT; Manufacturer1 ComponentHeight: 0.6mm; HelpURL: \\cern.ch\dfs\Applications\Altium\Datasheets\R0805_NIC_NRC.pdf; Author: CERN DEM JLC; CreateDate: 03.12.2007; LatestRevisionDate: 13.03.2008
R?#2 = R0805_75K_0.1%_0.125W_25PPM: Resistor - 0.1%; Part Description: Thin Film Chip Resistor; Manufacturer: GENERIC; Manufacturer1 Part Number: ERA6AEB753V; Power: 0.125W; TC: ±25ppm; PressFit: No; Part Number: R0805_75K_0.1%_0.125W_25PPM; Component Kind: Standard; Component Type: Standard; Pin Count: 2; Value: 75k; Status: Not Recommended; Tolerance: ±0.1%; Manufacturer Part Number: R0805_75K_0.1%_0.125W_25PPM; Case: 0805; Mounted: Yes; Sense: No; Socket: No; SMD: Yes; Manufacturer1 Example: PANASONIC; Manufacturer1 ComponentHeight: 0.6mm; HelpURL: \\cern.ch\dfs\Applications\Altium\Datasheets\R0805_PANASONIC_ERA.pdf; Author: CERN DEM JLC; CreateDate: 28.10.2013; LatestRevisionDate: 28.10.2013
R?#4 = R0402_10K_1%_0.0625W_100PPM: Resistor - 1%; Part Description: General Purpose Thick Film Chip Resistor; Manufacturer: GENERIC; Manufacturer1 Part Number: 232270671003L; TC: ±100ppm/°C; PressFit: No; Part Number: R0402_10K_1%_0.0625W_100PPM; Component Kind: Standard; Component Type: Standard; Pin Count: 2; Value: 10k; Status: Not Recommended; Power: 0.0625W; Tolerance: ±1%; Manufacturer Part Number: R0402_10K_1%_0.0625W_100PPM; Case: 0402; Mounted: Yes; Sense: No; Socket: No; SMD: Yes; Manufacturer1 Example: YAGEO PHYCOMP; Manufacturer1 ComponentHeight: 0.4mm; HelpURL: \\cern.ch\dfs\Applications\Altium\Datasheets\R0402_Phycomp_RC0402.pdf; Author: CERN DEM JLC; CreateDate: 03.12.2007; LatestRevisionDate: 17.10.2012
R?#5 R?#7 = R0402_4K3_1%_0.0625W_100PPM: Resistor - 1%; Part Description: General Purpose Thick Film Chip Resistor; Manufacturer: GENERIC; Manufacturer1 Part Number: 232270674302L; TC: ±100ppm/°C; PressFit: No; Part Number: R0402_4K3_1%_0.0625W_100PPM; Component Kind: Standard; Component Type: Standard; Pin Count: 2; Value: 4k3; Status: Not Recommended; Power: 0.0625W; Tolerance: ±1%; Manufacturer Part Number: R0402_4K3_1%_0.0625W_100PPM; Case: 0402; Mounted: Yes; Sense: No; Socket: No; SMD: Yes; Manufacturer1 Example: YAGEO PHYCOMP; Manufacturer1 ComponentHeight: 0.4mm; HelpURL: \\cern.ch\dfs\Applications\Altium\Datasheets\R0402_Phycomp_RC0402.pdf; Author: CERN DEM JLC; CreateDate: 03.12.2007; LatestRevisionDate: 17.10.2012
R?#8 = R2512_0R002_1%_1W_35PPM_VISHAY_WSK2512: Power and Current Sensing Resistor; Part Description: Power Metal Strip® Resistor, Low Value; Manufacturer: VISHAY DALE; Manufacturer Part Number: WSK25122L000FEA; Power: 1W; TC: ±35ppm/°C; Tolerance: ±1%; PressFit: No; Part Number: R2512_0R002_1%_1W_35PPM_VISHAY_WSK2512; Component Kind: Standard; Component Type: Standard; Pin Count: 4; Value: 0R002; Status: None; Case: 2512; Mounted: Yes; Sense: No; Socket: No; SMD: Yes; ComponentHeight: 0.89mm; HelpURL: \\cern.ch\dfs\Applications\Altium\Datasheets\R2512_VISHAY_WSK2512.pdf; Author: CERN DEM MR; CreateDate: 11/8/2016; LatestRevisionDate: 11/8/2016
RT? = THERM_NTC_10K_VISHAY_2381 640 54103: Thermistor NTC (Negative Temperature Coefficient); Part Description: NTC Thermistor, Radial Leaded; Manufacturer: VISHAY BCCOMPONENTS; Power: 100mW; Tolerance: ±2%; Part Number: THERM_NTC_10K_VISHAY_2381 640 54103; Component Kind: Standard; Component Type: Standard; Pin Count: 2; Value: 10k; Status: None; Manufacturer Part Number: 2381 640 54103; Mounted: Yes; Socket: No; SMD: No; Sense: No; ComponentHeight: 9mm; HelpURL: \\cern.ch\dfs\Applications\Altium\Datasheets\THERM_VISHAY_2381 640 5XXXX.pdf; Author: CERN DEM JLC; CreateDate: 07.04.2009; LatestRevisionDate: 07.04.2009
T?#1 = BC857B: PNP Transistor; Part Number: BC857B; Part Description: 45V 100mA PNP general-purpose transistors; Manufacturer: NXP SEMICONDUCTORS; PressFit: No; Bonding: No; Component Kind: Standard; Component Type: Standard; Device: BC857B; PackageDescription: SOT23, 3 pin, Pitch 0.95mm - 1.3mm W X 2.9mm L X 1.1mm H, IPC Medium Density; Manufacturer Part Number: BC857B; Pin Count: 3; Case: SOT23-3; Mounted: Yes; Socket: No; SMD: Yes; Sense: No; ComponentHeight: 1.1mm; HelpURL: \\cern.ch\dfs\Applications\Altium\Datasheets\BC857B.pdf; Author: CERN DEM JLC; CreateDate: 14.06.2011; LatestRevisionDate: 14.06.2011
T?#2 = IXTH80N20L_v: N-CHANNEL MOSFET WITH DIODE; Part Description: 200V 80A N-Channel Power MOSFET; Manufacturer: IXYS; PressFit: No; Bonding: No; Part Number: IXTH80N20L_v; Component Kind: Standard; Component Type: Standard; Device: IXTH80N20L; PackageDescription: TO-247AC 3-Terminal - Vertical Mount; Manufacturer Part Number: IXTH80N20L; Pin Count: 3; Case: TO-247; Mounted: Yes; Socket: No; SMD: No; Sense: No; ComponentHeight: 25.96mm; HelpURL: \\cern.ch\dfs\Applications\Altium\Datasheets\IXTH80N20L.pdf; Author: CERN DEM JLC; CreateDate: 23.09.2014; LatestRevisionDate: 23.09.2014